# Altium schematic sheet UnUsed MicroController Pins.SchDoc: UnUsed MicroController Pins
size 292 x 193 mm; SheetNumber: 20; SheetTotal: 28
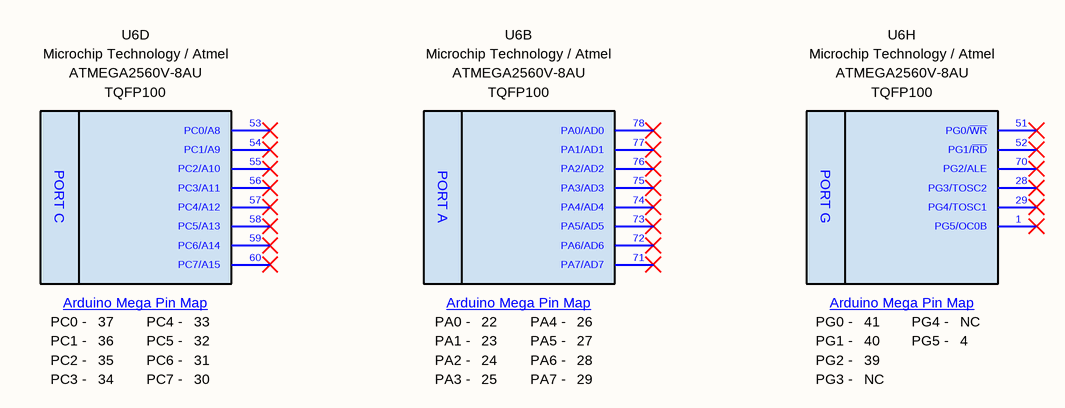
[diagram p0: UnUsed MicroController Pins.SchDoc]

## Parts
U6  Manufacturer Name: Microchip Technology / Atmel  Case: TQFP100  [TQFP-100]  (hidden comment: ATMEGA2560V-8AU)  (parts B,D,H of 16)

## Nets

Not connected (* = marked no-connect by the designer): U6 1(PG5/OC0B)* 28(PG3/TOSC2)* 29(PG4/TOSC1)* 51(PG0/~{WR})* 52(PG1/~{RD})* 53(PC0/A8)* 54(PC1/A9)* 55(PC2/A10)* 56(PC3/A11)* 57(PC4/A12)* 58(PC5/A13)* 59(PC6/A14)* 60(PC7/A15)* 70(PG2/ALE)* 71(PA7/AD7)* 72(PA6/AD6)* 73(PA5/AD5)* 74(PA4/AD4)* 75(PA3/AD3)* 76(PA2/AD2)* 77(PA1/AD1)* 78(PA0/AD0)*

## Notes on the sheet
- © 2021 All rights reserved.
  This document may not, in whole or in part, be copied, photocopied, reproduced, translated or converted to any electronic or machine readable from without prior written permission of Mehmet Günce Akkoyun.
  Engineer contact : akkoyun@me.com
- Property of
- Engineer :
- Date :
- Size :
- A4
- Time :
- Project :
- Page :
- /
- Customer :
- Product ID :
- Module ID :
- Version :
- File :
- Revision :
- (in symbol IC - AtMega2560V-8AU, part B) PORT A; Arduino Mega Pin Map; PA0 -; PA4 -; PA1 -; PA5 -; PA2 -; PA6 -; PA3 -; PA7 -
- (in symbol IC - AtMega2560V-8AU, part D) PORT C; Arduino Mega Pin Map; PC0 -; PC4 -; PC1 -; PC5 -; PC2 -; PC6 -; PC3 -; PC7 -
- (in symbol IC - AtMega2560V-8AU, part H) PORT G; Arduino Mega Pin Map; PG0 -; PG4 -; NC; PG1 -; PG5 -; PG2 -; PG3 -

## Library data of the parts
U6 = IC - AtMega2560V-8AU: ATmega Series 256 KB Flash 8 KB SRAM 8 MHz 8-Bit Microcontroller - TQFP-100; Program Memory Size: 256 kB; Core: AVR; Operating Supply Voltage: 2.7 V to 5.5 V; Maximum Clock Frequency: 8 MHz; Maximum Operating Temperature: + 85 C; Product Type: MicroControllers; Minimum Operating Temperature: - 40 C; Manufacturer Part Number: ATMEGA2560V-8AU